# Altium schematic sheet exio.SchDoc
size A4
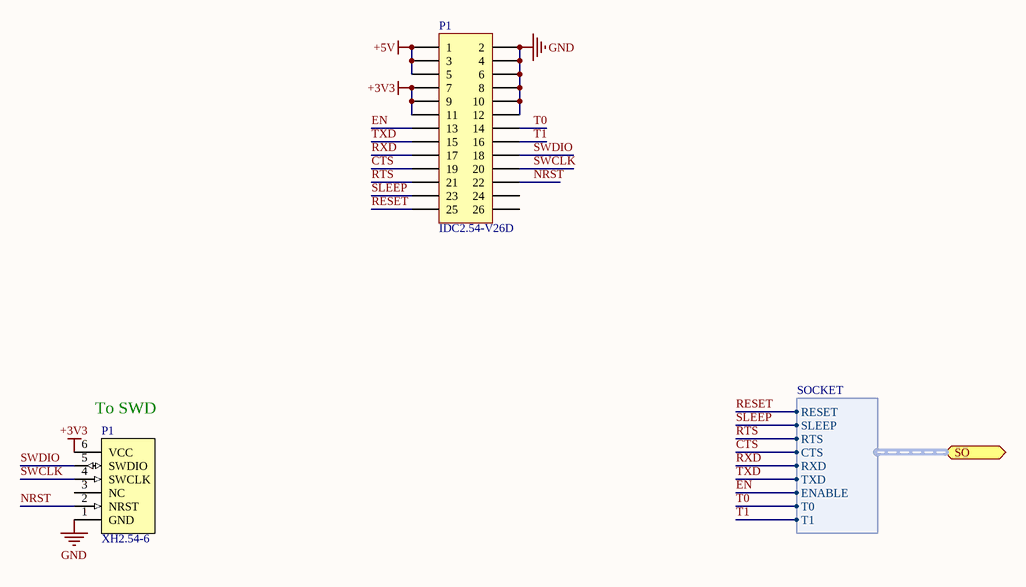
[diagram p0: exio.SchDoc]

## Parts
(Parts that share a designator on the sheet are numbered #1, #2 ... from top to bottom, then left to right.)
P1#1  IDC2.54-V26D  [IDC2.54-V26D]
P1#2  XH2.54-6  [REAL_SIP6_2.54]

## Ports
SO (harness SOCKET)

## Harnesses
SOCKET: ENABLE, TXD, RXD, CTS, RTS, SLEEP, RESET, T0, T1

## Nets
+3V3: P1#1.7 P1#1.9 P1#1.11 P1#2.6(VCC)
+5V: P1#1.1 P1#1.3 P1#1.5
GND: P1#1.2 P1#1.4 P1#1.6 P1#1.8 P1#1.10 P1#1.12 P1#2.1(GND)
CTS: P1#1.19 ; port SO.CTS
EN: P1#1.13 ; port SO.ENABLE
NRST: P1#1.22 P1#2.2(NRST)
RESET: P1#1.25 ; port SO.RESET
RTS: P1#1.21 ; port SO.RTS
RXD: P1#1.17 ; port SO.RXD
SLEEP: P1#1.23 ; port SO.SLEEP
SWCLK: P1#1.20 P1#2.4(SWCLK)
SWDIO: P1#1.18 P1#2.5(SWDIO)
T0: P1#1.14 ; port SO.T0
T1: P1#1.16 ; port SO.T1
TXD: P1#1.15 ; port SO.TXD

Not connected (* = marked no-connect by the designer): P1#1 24 26; P1#2 3(NC)

## Notes on the sheet
- (near P1#2) To SWD

## Library data of the parts
P1#1 = Header 13X2: IDC2.54-13x2 Header; LatestRevisionDate: 17-Jul-2002; LatestRevisionNote: Re-released for DXP Platform.; Publisher: Altium Limited; Price: 0.38
P1#2 = SWD-Connector: SW debug connector